# Altium schematic sheet Power.SchDoc
size A
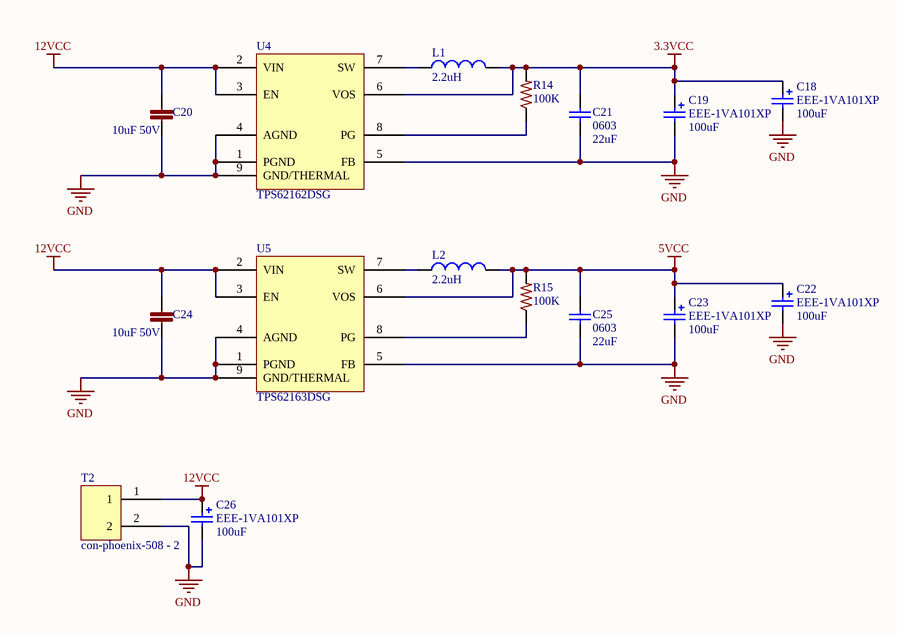
[diagram p0: Power.SchDoc]

## Parts
C18  EEE-1VA101XP  value 100uF  [EEE-1VA101XP]
C19  EEE-1VA101XP  value 100uF  [EEE-1VA101XP]
C20  10uF 50V  [C1206]
C21  0603  value 22uF  [C0805]
C22  EEE-1VA101XP  value 100uF  [EEE-1VA101XP]
C23  EEE-1VA101XP  value 100uF  [EEE-1VA101XP]
C24  10uF 50V  [C1206]
C25  0603  value 22uF  [C0805]
C26  EEE-1VA101XP  value 100uF  [EEE-1VA101XP]
L1  value 2.2uH  [VLS252012T-2R2M1R3]  (hidden comment: VLS252012T-2R2M1R3)
L2  value 2.2uH  [VLS252012T-2R2M1R3]  (hidden comment: VLS252012T-2R2M1R3)
R14  100K  [R0603]
R15  100K  [R0603]
T2  con-phoenix-508 - 2  [MSTBV2 - duplicate]
U4  TPS62162DSG  [DSG8-1600X900TP]
U5  TPS62163DSG  [DSG8-1600X900TP]

## Nets
3.3VCC: C18.1 C19.1 C21.2 L1.2 R14.2 U4.6(VOS)
5VCC: C22.1 C23.1 C25.2 L2.2 R15.2 U5.6(VOS)
12VCC: C20.1 C24.1 C26.1 T2.1 U4.2(VIN) U4.3(EN) U5.2(VIN) U5.3(EN)
GND: C18.2 C19.2 C20.2 C21.1 C22.2 C23.2 C24.2 C25.1 C26.2 T2.2 U4.1(PGND) U4.4(AGND) U4.5(FB) U4.9(GND/THERMAL) U5.1(PGND) U5.4(AGND) U5.5(FB) U5.9(GND/THERMAL)
NetL1_1: L1.1 U4.7(SW)
NetL2_1: L2.1 U5.7(SW)
NetR14_1: R14.1 U4.8(PG)
NetR15_1: R15.1 U5.8(PG)

## Library data of the parts
C18 C19 C22 C23 C26 = EEE-1VA101XP: CAP ALUM 100UF 35V 20% SMD; Manufacture: Panasonic; Digikey Part #: PCE3951CT-ND; Price: $0.63; Mount Type: SMT Panasonic VS D Series; Status: Active; Height: 7.70mm; Datasheet: http://industrial.panasonic.com/www-cgi/jvcr13pz.cgi?E+PZ+3+ABA0002+EEE1VA101XP+7+WW; Manufacture Part #: EEE-1VA101XP
C20 C24 = CL31A106KBHNNNE: CAP CER 10UF 50V 10% X5R 1206; Manufacturer: Samsung; LastRevisionNote: ImportComponents; Published: 25-mar-2015; Publisher: UltiMachine; LastRevisionDate: 25-mar-2015; ManufacturerPartNumber: CL31A106KBHNNNE; VALUE: 10uF 50V
C21 C25 = CL21A226KQQNNNE: CAP CER 22UF 6.3V 10% X5R 0805; MFR: Samsung; Voltage: 6.3VDC; Published: April 2015; LatestRevisionDate: April 2015; Component Type: Chip Capacitor; MFR Part #: CL21A226KQQNNNE; Part Description: CAP CER 22UF 6.3V 10% X5R 0805; Mounting Type: SMT 0805; Datasheet: http://www.digikey.com/product-detail/en/CL21A226KQQNNNE/1276-2907-2-ND/3888565; Height: 1mm; Tolerance: 10%; Digikey #: 1276-2907-2-ND; PackageReference: 0805
L1 L2 = VLS252012T-2R2M1R3: MFR: TDK Corporation; Published: April 2015; LatestRevisionDate: April 2015; LatestRevisionNote: IPC-7351 Footprint Added.; PackageReference: Custom Wound INductor; Publisher: Adam Vadala-Roth; PackageDescription: Wire Wound Inductor Package; MFR#: VLS252012T-2R2M1R3
R14 R15 = RC0603FR-07100KL: RES 100K OHM 1/10W 1% 0603 SMD; LastRevisionNote: ImportComponents; Published: 23-Apr-2014; Publisher: UltiMachine; LastRevisionDate: 23-Apr-2014; ManufacturerPartNumber: RC0603FR-07100KL; VALUE: 100K
T2 = con-phoenix-508_2
U4 U5 = TPS62162SOP